# EAGLE design QED_2550_dos_caras (EAGLE 6.1)
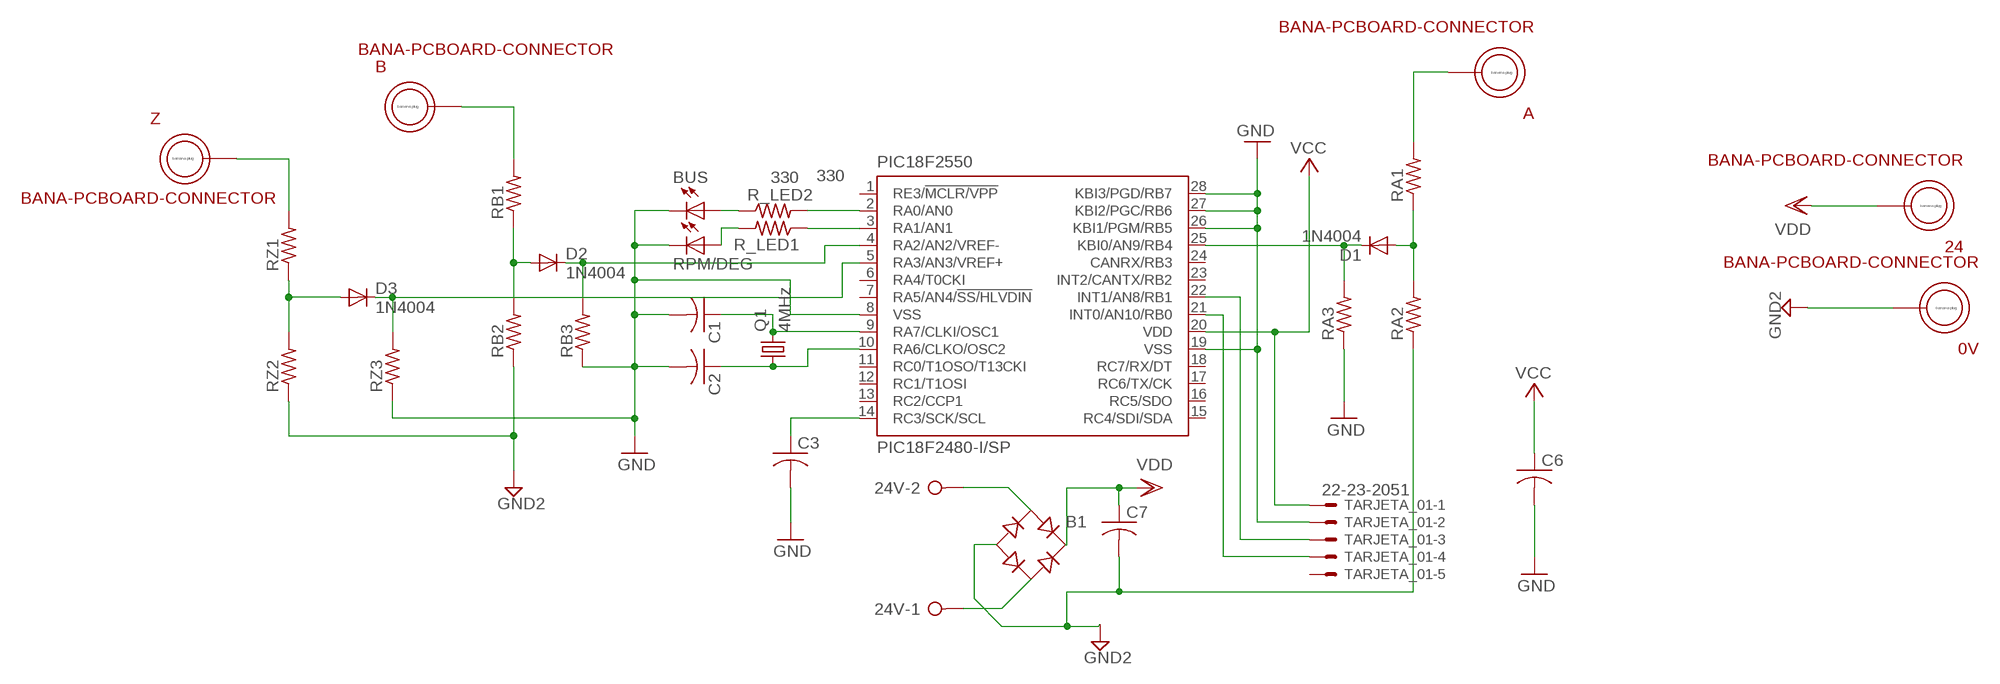
[diagram p0: schematic, sheet 1]

## Parts
0V  BANA-PCBOARD-CONNECTOR  [BANA_PLUG]
24  BANA-PCBOARD-CONNECTOR  [BANA_PLUG]
24V  W237-02P  [W237-132]
A  BANA-PCBOARD-CONNECTOR  [BANA_PLUG]
B  BANA-PCBOARD-CONNECTOR  [BANA_PLUG]
B1  RB1A  [RB1A]
BUS  LED5MM  [LED5MM]
C1  C-US025-024X044  [C025-024X044]
C2  C-US025-024X044  [C025-024X044]
C3  C-US025-024X044  [C025-024X044]
C6  C-US025-030X050  [C025-030X050]
C7  C-US025-030X050  [C025-030X050]
D1  1N4004  [DO41-10]
D2  1N4004  [DO41-10]
D3  1N4004  [DO41-10]
PIC18F2550  PIC18F2480-I/SP  [DIL28-3]
Q1  4MHz  CRYSTALHC49S  [HC49/S]
R_LED1  330  R-US_0204/7  [0204/7]
R_LED2  330  R-US_0204/7  [0204/7]
RA1  R-US_0204/7  [0204/7]
RA2  R-US_0204/7  [0204/7]
RA3  R-US_0204/7  [0204/7]
RB1  R-US_0204/7  [0204/7]
RB2  R-US_0204/7  [0204/7]
RB3  R-US_0204/7  [0204/7]
RPM/DEG  LED5MM  [LED5MM]
RZ1  R-US_0204/7  [0204/7]
RZ2  R-US_0204/7  [0204/7]
RZ3  R-US_0204/7  [0204/7]
TARJETA_01  22-23-2051  [22-23-2051]
Z  BANA-PCBOARD-CONNECTOR  [BANA_PLUG]

## Nets
GND: BUS.K(C) C1.2 C2.2 C3.2 C6.2 PIC18F2550.8(VSS) PIC18F2550.19(VSS) PIC18F2550.26(KBI1/PGM/RB5) PIC18F2550.27(KBI2/PGC/RB6) PIC18F2550.28(KBI3/PGD/RB7) RA3.1 RB3.1 RPM/DEG.K(C) RZ3.1 TARJETA_01.2
GND2: 0V.P$1 B1.- C7.2 RA2.1 RB2.1 RZ2.1
N$1: C1.1 PIC18F2550.9(RA7/CLKI/OSC1) Q1.2
N$2: C2.1 PIC18F2550.10(RA6/CLKO/OSC2) Q1.1
N$3: C3.1 PIC18F2550.14(RC3/SCK/SCL)
N$4: PIC18F2550.2(RA0/AN0) R_LED2.2
N$5: BUS.A R_LED2.1
N$6: PIC18F2550.3(RA1/AN1) R_LED1.1
N$7: R_LED1.2 RPM/DEG.A
N$8: D1.A RA1.1 RA2.2
N$9: D1.C PIC18F2550.25(KBI0/AN9/RB4) RA3.2
N$10: D2.A RB1.1 RB2.2
N$11: D2.C PIC18F2550.4(RA2/AN2/VREF-) RB3.2
N$12: RZ1.2 Z.P$1
N$13: 24V.2 B1.AC1
N$14: 24V.1 B1.AC2
N$15: PIC18F2550.22(INT1/AN8/RB1) TARJETA_01.3
N$16: B.P$1 RB1.2
N$17: A.P$1 RA1.2
N$18: PIC18F2550.21(INT0/AN10/RB0) TARJETA_01.4
N$19: D3.A RZ1.1 RZ2.2
N$21: D3.C PIC18F2550.5(RA3/AN3/VREF+) RZ3.2
VCC: C6.1 PIC18F2550.20(VDD) TARJETA_01.1
VDD: 24.P$1 B1.+ C7.1
Unconnected: PIC18F2550.1(RE3/!MCLR/VPP) PIC18F2550.6(RA4/T0CKI) PIC18F2550.7(RA5/AN4/!SS/HLVDIN) PIC18F2550.11(RC0/T1OSO/T13CKI) PIC18F2550.12(RC1/T1OSI) PIC18F2550.13(RC2/CCP1) PIC18F2550.15(RC4/SDI/SDA) PIC18F2550.16(RC5/SDO) PIC18F2550.17(RC6/TX/CK) PIC18F2550.18(RC7/RX/DT) PIC18F2550.23(INT2/CANTX/RB2) PIC18F2550.24(CANRX/RB3) TARJETA_01.5

## Library data of the parts
0V 24 A B Z = banana-plug:BANA-PCBOARD-CONNECTOR: Banana Plug to PC Board connector
24V = con-wago-508:W237-02P: WAGO SREW CLAMP; OC_FARNELL: unknown; OC_NEWARK: unknown
B1 = rectifier:RB1A: RECTIFIER 1 A
BUS RPM/DEG = led:LED: LED OSRAM: - CHIPLED LG R971, LG N971, LY N971, LG Q971, LY Q971, LO R971, LY R971 LH N974, LH R974 LS Q976, LO Q976, LY Q976 LO Q996 - Hyper CHIPLED LW Q18S LB Q993, LB Q99A, LB R99A - SideLED LS A670, LO A670, LY A670, LG A670, LP A670 LB A673, LV A673, LT A673, LW A673 LH A674 LY A675 LS A676, LA A676, LO A676, LY A676, LW A676 LS A679, LY A679, LG A679 - Hyper Micro SIDELED® LS Y876, LA Y876, LO Y876, LY Y876 LT Y87S - SmartLED LW L88C, LW L88S LB L89C, LB L89S, LG L890 LS L89K, LO L89K, LY L89K LS L896, LA L896, LO L896, LY L896 - TOPLED LS T670, LO T670, LY T670, LG T670, LP T670 LSG T670, LSP T670, LSY T670, LOP T670, LYG T670 LG T671, LOG T671, LSG T671 LB T673, LV T673, LT T673, LW T673 LH T674 LS T676, LA T676, LO T676, LY T676, LB T676, LH T676, LSB T676, LW T676 LB T67C, LV T67C, LT T67C, LS T67K, LO T67K, LY T67K, LW E67C LS E67B, LA E67B, LO E67B, LY E67B, LB E67C, LV E67C, LT E67C LW T67C LS T679, LY T679, LG T679 LS T770, LO T770, LY T770, LG T770, LP T770 LB T773, LV T773, LT T773, LW T773 LH T774 LS E675, LA E675, LY E675, LS T675 LS T776, LA T776, LO T776, LY T776, LB T776 LHGB T686 LT T68C, LB T68C - Hyper Mini TOPLED® LB M676 - Mini TOPLED Santana® LG M470 LS M47K, LO M47K, LY M47K Source: http://www.osram.convergy.de LUXEON: - LUMILED® LXK2-PW12-R00, LXK2-PW12-S00, LXK2-PW14-U00, LXK2-PW14-V00 LXK2-PM12-R00, LXK2-PM12-S00, LXK2-PM14-U00 LXK2-PE12-Q00, LXK2-PE12-R00, LXK2-PE12-S00, LXK2-PE14-T00, LXK2-PE14-U00 LXK2-PB12-K00, LXK2-PB12-L00, LXK2-PB12-M00, LXK2-PB14-N00, LXK2-PB14-P00, LXK2-PB14-Q00 LXK2-PR12-L00, LXK2-PR12-M00, LXK2-PR14-Q00, LXK2-PR14-R00 LXK2-PD12-Q00, LXK2-PD12-R00, LXK2-PD12-S00 LXK2-PH12-R00, LXK2-PH12-S00 LXK2-PL12-P00, LXK2-PL12-Q00, LXK2-PL12-R00 Source: www.luxeon.com KINGBRIGHT: KA-3528ASYC Source: www.kingbright.com
C1-C3 C6 C7 = rcl:C-US: CAPACITOR, American symbol
D1-D3 = diode:1N4004: DIODE general purpose rectifier, 1 A
PIC18F2550 = microchip:PIC18F2*80: 28-Pin Enhanced Flash Microcontrollers with ECAN(TM) Technology 10-Bit A/D and nanoWatt Technology Source: http://www.microchip.com .. 39637a.pdf; MF: MICROCHIP; MPN: PIC18F2480-I/SP; OC_FARNELL: 9321217; OC_NEWARK: 71J7237
Q1 = crystal:CRYSTAL: CRYSTAL; OC_FARNELL: 1667008; OC_NEWARK: unknown
R_LED1 R_LED2 RA1-RA3 RB1-RB3 RZ1-RZ3 = rcl:R-US_: RESISTOR, American symbol
TARJETA_01 = con-molex:22-23-2051: .100" (2.54mm) Center Header - 5 Pin; MF: MOLEX; MPN: 22-23-2051; OC_FARNELL: 1462952; OC_NEWARK: 38C9178

## Board
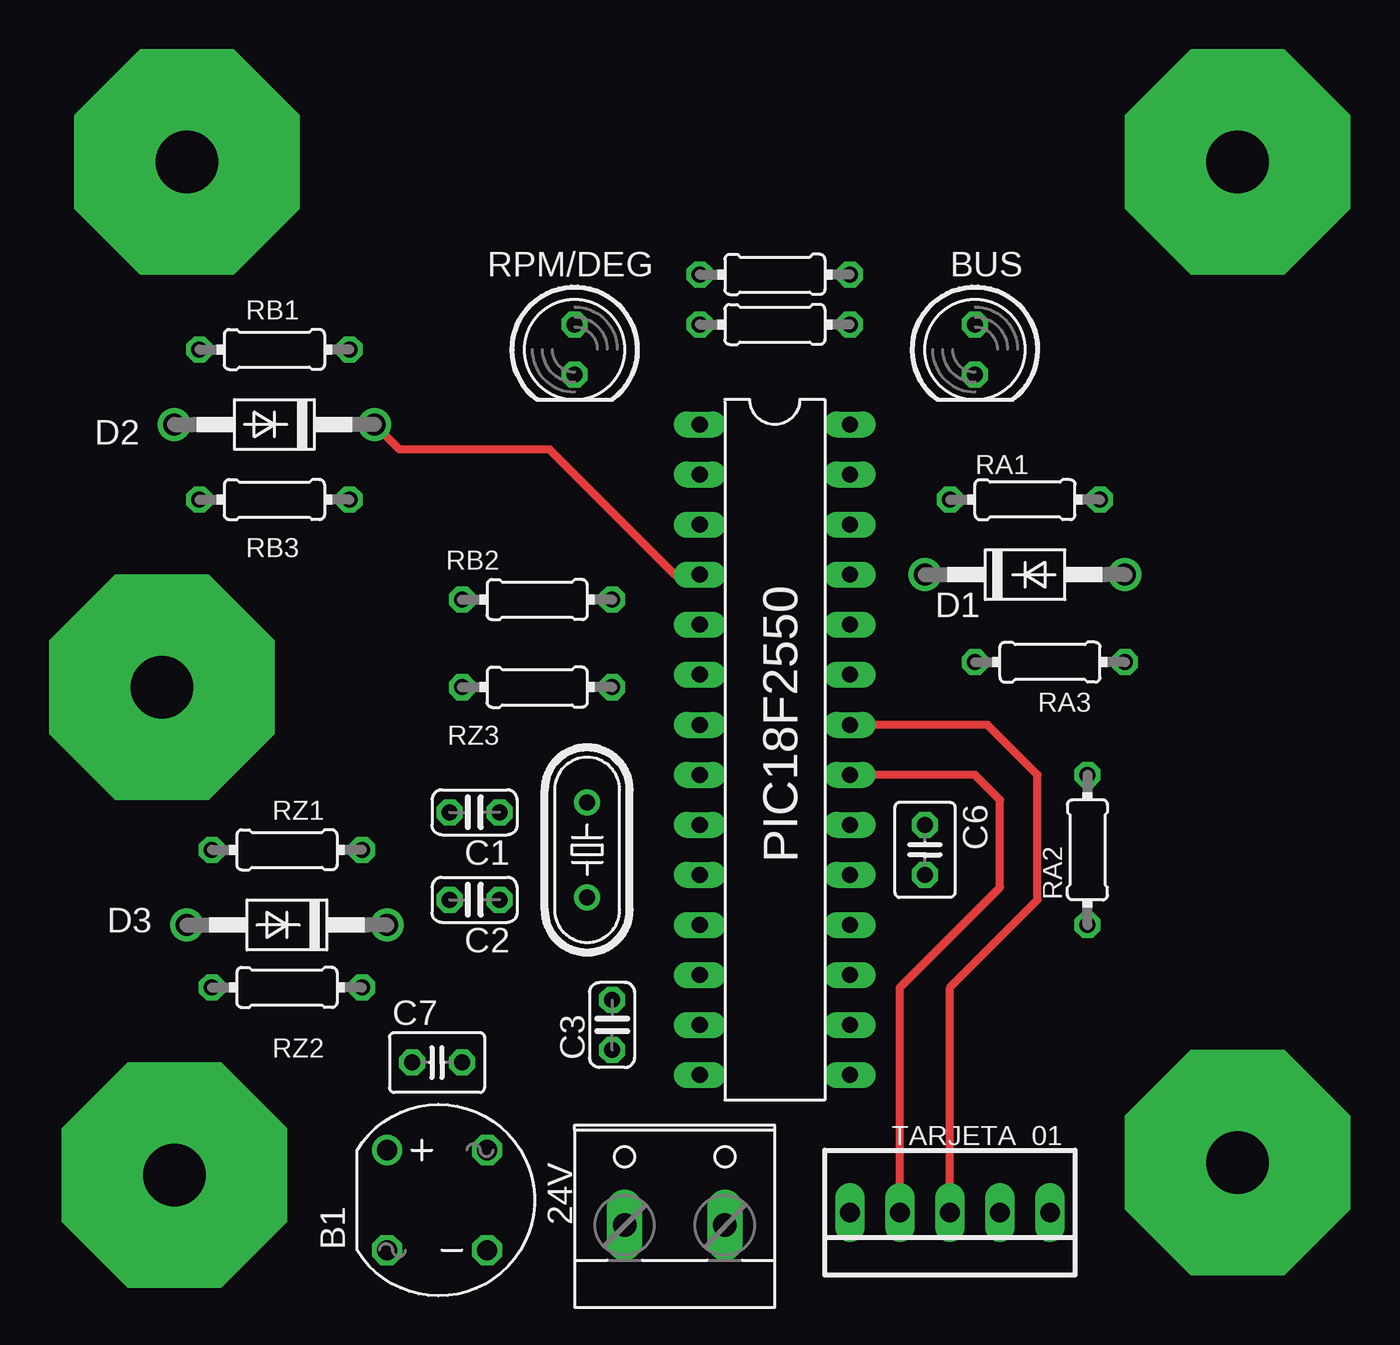
[diagram p1: board, top side]
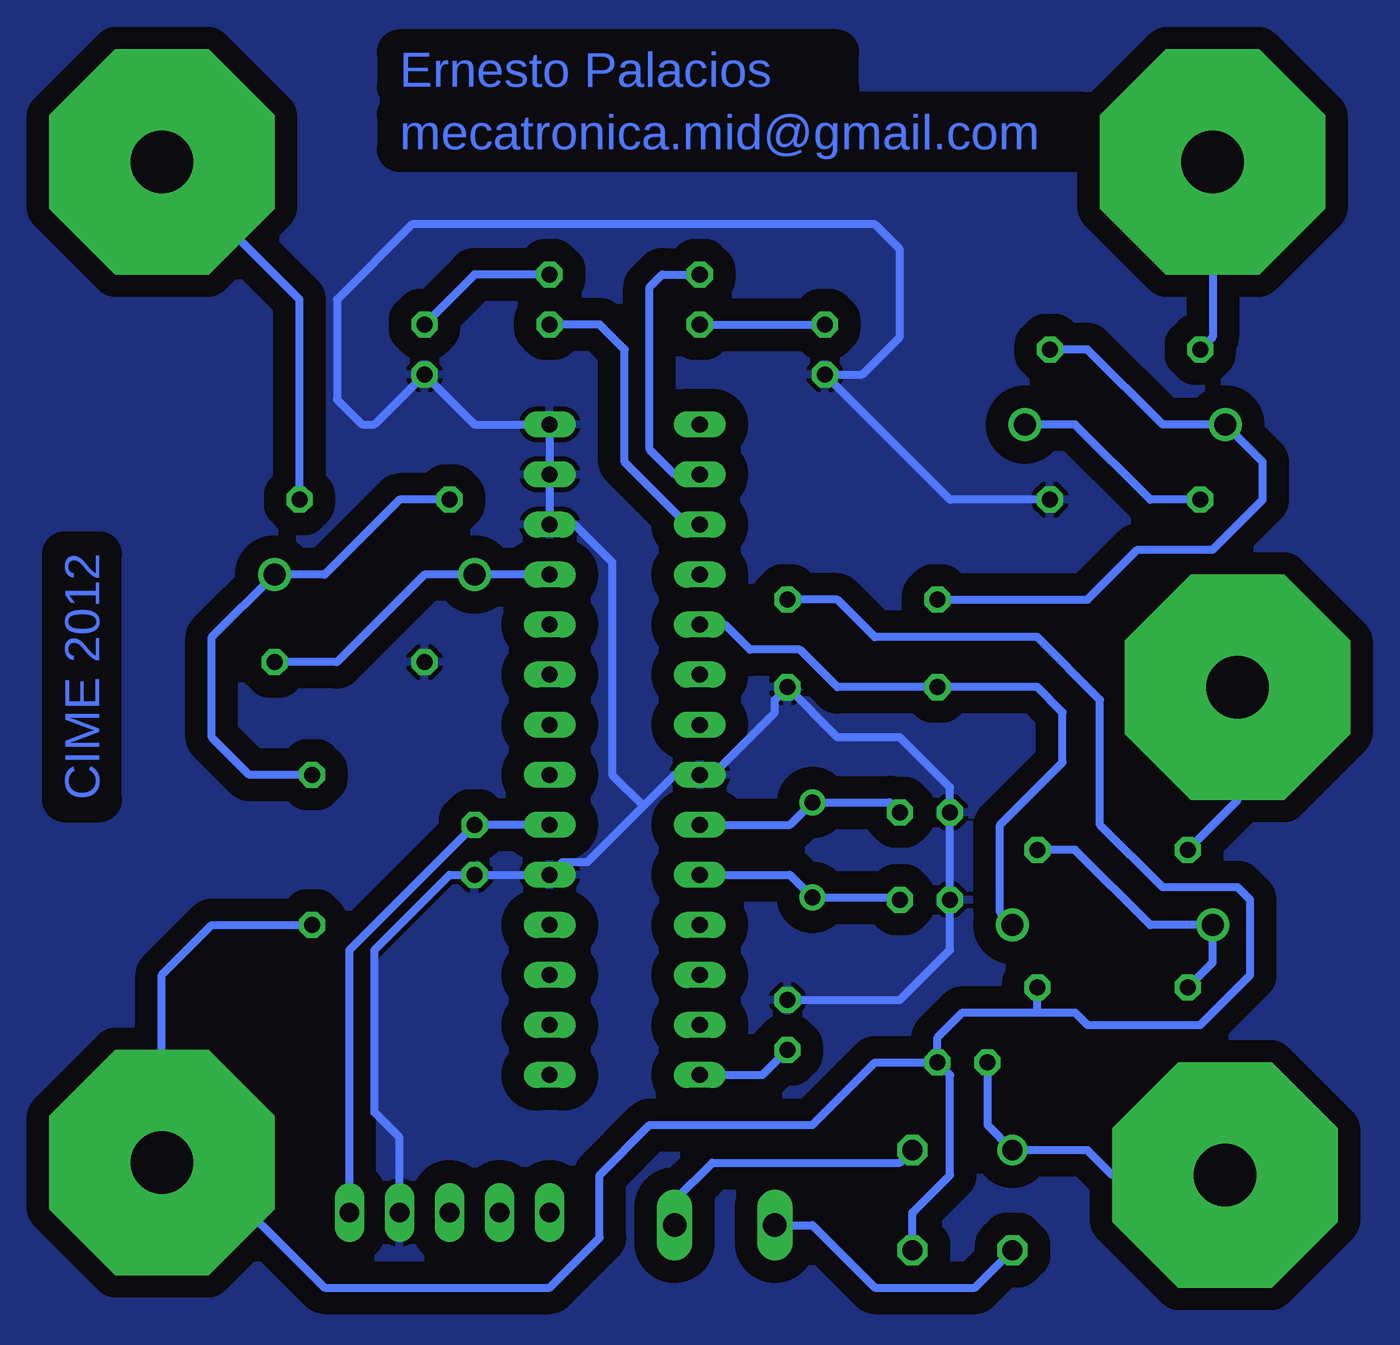
[diagram p2: board, bottom side, seen from below]

No outline drawn. Coordinates in mm, seen from the top.
Copper layers (1*16): Top 0.035mm / dielectric 1.5mm / Bottom 0.035mm
Design rules: minimum track width 10mil, minimum drill 24mil, track to track 45mil, track to pad 45mil, pad to pad 45mil, via to via 45mil, smd to smd 45mil, copper to edge 40mil, drill to drill 8mil, minimum pad ring 10mil, minimum via ring 8mil, stop-mask expansion 4mil, vias tented up to drill 0mil, thermal gap 10mil

### Footprints (pad centres in the part's own frame; a part is rotated, then mirrored left to right if it is on the bottom)
BANA_PLUG = drill 3.175 pad 11.43 octagon: P$1 0,0
W237-132 = drill 1.194 long: 1 -2.54,-0.635; 2 2.54,-0.635
RB1A = drill 1.016: + -2.54,2.54 | drill 1.016 octagon: - 2.54,-2.54; AC1 2.54,2.54; AC2 -2.54,-2.54
LED5MM = drill 0.813 octagon: A -1.27,0; K 1.27,0
C025-024X044 = drill 0.813 octagon: 1 -1.27,0; 2 1.27,0
C025-030X050 = drill 0.813 octagon: 1 -1.27,0; 2 1.27,0
DO41-10 = drill 1.118: A 5.08,0; C -5.08,0
DIL28-3 = drill 0.813 long: 1 -16.51,-3.81; 2 -13.97,-3.81; 3 -11.43,-3.81; 4 -8.89,-3.81; 5 -6.35,-3.81; 6 -3.81,-3.81; 7 -1.27,-3.81; 8 1.27,-3.81; 9 3.81,-3.81; 10 6.35,-3.81; 11 8.89,-3.81; 12 11.43,-3.81; 13 13.97,-3.81; 14 16.51,-3.81; 15 16.51,3.81; 16 13.97,3.81; 17 11.43,3.81; 18 8.89,3.81; 19 6.35,3.81; 20 3.81,3.81; 21 1.27,3.81; 22 -1.27,3.81; 23 -3.81,3.81; 24 -6.35,3.81; 25 -8.89,3.81; 26 -11.43,3.81; 27 -13.97,3.81; 28 -16.51,3.81
HC49/S = drill 0.813: 1 -2.413,0; 2 2.413,0
0204/7 = drill 0.813 octagon: 1 -3.81,0; 2 3.81,0
22-23-2051 = drill 1 long: 1 -5.08,0; 2 -2.54,0; 3 0,0; 4 2.54,0; 5 5.08,0

### Placement (x,y rotation side)
0V  64.14,9.53 0 top
24  10.16,8.89 0 top
24V  35.56,6.99 0 top
A  64.14,60.33 0 top
B  10.79,60.33 0 top
B1  23.5,7.62 0 top
BUS  50.8,50.8 270 top
C1  25.4,27.3 180 top
C2  25.4,22.86 180 top
C3  32.38,16.51 90 top
C6  48.26,25.4 270 top
C7  23.5,14.61 0 top
D1  53.34,39.37 0 top
D2  15.24,46.99 180 top
D3  15.88,21.59 180 top
PIC18F2550  40.64,30.48 270 top
Q1  31.11,25.4 90 top
R_LED1  40.64,52.07 180 top
R_LED2  40.64,54.61 180 top
RA1  53.34,43.18 0 top
RA2  56.52,25.4 90 top
RA3  54.61,34.92 0 top
RB1  15.24,50.8 180 top
RB2  28.57,38.1 180 top
RB3  15.24,43.18 180 top
RPM/DEG  30.48,50.8 270 top
RZ1  15.88,25.4 180 top
RZ2  15.88,18.41 180 top
RZ3  28.57,33.66 180 top
TARJETA_01  49.53,6.99 180 top
Z  9.53,33.66 0 top

### Tracks (layer width: path | path; a pad name or v marks a point on that pad's centre or on a via)
GND
  Bottom 0.406: 39.69,27.62 38.1,29.21 PIC18F2550.8 36.2,29.21 33.02,32.38 33.02,33.02 RZ3.1 29.84,31.11 26.67,31.11 24.13,28.57 C1.2 C2.2 24.13,20.32 26.67,17.78 C3.2 | 39.69,27.62 42.55,24.77 43.81,24.77 PIC18F2550.19 C6.2 49.53,24.13 53.34,20.32 53.34,12.06 52.07,10.79 TARJETA_01.2 | RB3.1 24.13,43.18 RPM/DEG.K 28.57,49.53 26.67,51.44 26.67,55.88 27.94,57.15 51.44,57.15 55.24,53.34 55.24,48.26 53.98,46.99 53.34,46.99 BUS.K 48.26,46.99 PIC18F2550.28 PIC18F2550.27 PIC18F2550.26 43.18,41.91 41.27,40.01 41.27,29.21 39.69,27.62
  pour Bottom: 1.27,0 1.27,69.85 73.66,69.85 73.66,0
GND2
  Bottom 0.406: B1.- 26.04,6.99 24.13,8.89 24.13,13.97 C7.2 | C7.2 24.77,15.88 23.5,17.14 19.68,17.14 | 19.68,17.14 RZ2.1 | 19.68,17.14 17.78,17.14 17.14,16.51 11.43,16.51 8.89,19.05 8.89,22.86 9.53,23.5 13.34,23.5 16.51,26.67 16.51,33.02 19.68,36.2 27.94,36.2 29.84,38.1 RB2.1 | 0V.P$1 62.23,9.53 | 62.23,9.53 55.88,3.17 44.45,3.17 41.91,5.71 41.91,8.89 39.37,11.43 31.11,11.43 27.94,14.61 C7.2 | 62.23,9.53 62.23,12.06 64.14,13.97 64.14,19.05 61.59,21.59 RA2.1
N$1
  Bottom 0.406: PIC18F2550.9 32.26,26.67 Q1.2 27.18,27.81 C1.1
N$2
  Bottom 0.406: PIC18F2550.10 32.26,24.13 Q1.1 26.8,22.99 C2.1
N$3
  Bottom 0.406: PIC18F2550.14 33.66,13.97 C3.1
N$4
  Bottom 0.406: PIC18F2550.2 38.1,44.45 39.37,45.72 39.37,53.98 38.73,54.61 R_LED2.2
N$5
  Bottom 0.406: R_LED2.1 48.26,54.61 BUS.A
N$6
  Bottom 0.406: PIC18F2550.3 37.47,41.91 40.64,45.09 40.64,50.8 41.91,52.07 R_LED1.1
N$7
  Bottom 0.406: R_LED1.2 RPM/DEG.A
N$8
  Bottom 0.406: RA1.1 52.07,43.18 55.88,39.37 D1.A 61.59,36.2 61.59,31.11 59.69,29.21 RA2.2
N$9
  Bottom 0.406: RA3.2 55.24,34.92 50.8,39.37 D1.C PIC18F2550.25
N$10
  Bottom 0.406: RB2.2 17.14,38.1 14.61,40.64 10.79,40.64 8.26,43.18 8.26,45.09 D2.A 13.34,46.99 17.14,50.8 RB1.1
N$11
  Top 0.406: PIC18F2550.4 35.56,39.37 29.21,45.72 21.59,45.72 D2.C
  Bottom 0.406: RB3.2 13.97,43.18 17.78,46.99 D2.C
N$12
  Bottom 0.406: Z.P$1 9.53,27.94 RZ1.2
N$13
  Bottom 0.406: 24V.2 38.1,7.62 36.2,9.53 26.67,9.53 B1.AC1
N$14
  Bottom 0.406: 24V.1 31.11,6.35 27.94,3.17 22.86,3.17 B1.AC2
N$15
  Top 0.406: TARJETA_01.3 49.53,18.41 53.98,22.86 53.98,29.21 51.44,31.75 PIC18F2550.22
N$16
  Bottom 0.406: B.P$1 10.79,51.44 RB1.2
N$17
  Bottom 0.406: RA1.2 57.15,53.34 A.P$1
N$18
  Top 0.406: TARJETA_01.4 46.99,18.41 52.07,23.5 52.07,27.94 50.8,29.21 PIC18F2550.21
N$19
  Bottom 0.406: RZ1.1 17.78,25.4 13.97,21.59 D3.A 10.79,19.68 RZ2.2
N$21
  Bottom 0.406: PIC18F2550.5 35.56,36.83 34.29,35.56 31.75,35.56 29.84,33.66 RZ3.2 19.68,33.66 18.41,32.38 18.41,29.84 21.59,26.67 21.59,22.23 D3.C
VCC
  Bottom 0.406: PIC18F2550.20 C6.1 54.61,20.32 TARJETA_01.1
VDD
  Bottom 0.406: 24.P$1 15.88,8.89 17.14,10.16 B1.+ 22.23,11.43 C7.1

### Text on the board
Bottom: Ernesto Palacios | mecatronica.mid@gmail.com | CIME 2012